# Altium project precharge.PrjPcb
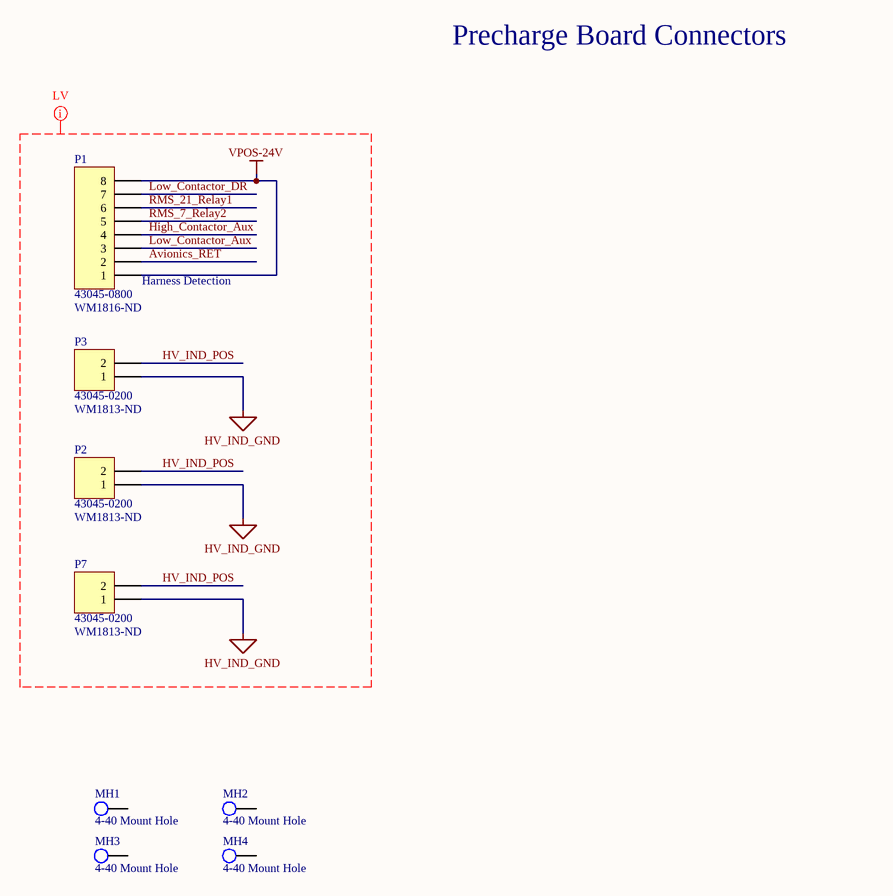
[diagram p0: connectors.SchDoc]
4 sheets, 59 parts. Net scope: global (net labels, ports and power ports of the same name join across sheets).
Board file: precharge.PcbDoc
Sheets:
  connectors.SchDoc
  indicator_light.SchDoc
  precharge_relays.SchDoc
  Contactors.SchDoc

## Sheet connectors.SchDoc: Connectors
size A4; Engineer: Shelby Riggleman; Organization: Badgerloop Electrical; Address1: 133 Engineering Research Building; Address2: 1500 Engineering Drive; Address3: Madison, Wi 53706; Revision: 1; SheetNumber: 2

### Parts
MH1  4-40 Mount Hole  [MH]
MH2  4-40 Mount Hole  [MH]
MH3  4-40 Mount Hole  [MH]
MH4  4-40 Mount Hole  [MH]
P1  43045-0800  Supplier Part Number 1: WM1816-ND  [430450800]
P2  43045-0200  Supplier Part Number 1: WM1813-ND  [430450200]
P3  43045-0200  Supplier Part Number 1: WM1813-ND  [430450200]
P7  43045-0200  Supplier Part Number 1: WM1813-ND  [430450200]

### Nets
HV_IND_GND: P2.1 P3.1 P7.1
VPOS-24V: P1.1 P1.8
Avionics_RET: P1.2
High_Contactor_Aux: P1.4
HV_IND_POS: P2.2 P3.2 P7.2
Low_Contactor_Aux: P1.3
Low_Contactor_DR: P1.7
RMS_7_Relay2: P1.5
RMS_21_Relay1: P1.6

Not connected (* = marked no-connect by the designer): MH1 46; MH2 46; MH3 46; MH4 46

### Layout directives
net class Low Voltage: Avionics_RET, High_Contactor_Aux, HV_IND_GND, HV_IND_POS, Low_Contactor_Aux, Low_Contactor_DR, RMS_7_Relay2, RMS_21_Relay1, VPOS-24V

### Notes on the sheet
- Precharge Board Connectors
- (near P1) Harness Detection
- Title
- Engineer:
- Date:
- Time:
- Revision:
- Sheet
- of
- File:

### Library data of the parts
P1 = 43045-0800: CONN HEADER R/A 8POS 3MM; Manufacturer: Molex; Number of Contacts: 8; Contact Resistance: 10mR; Max Voltage Rating (DC): 250.25kV; Current Rating: 5A; Voltage Rating (AC): 250V; Voltage Rating: 600V; Gender: Male; Insulation Resistance: 1GR; Approvals: UL,CSA,TUV; Glow Wire Compliant: Compliant; Supplier 1: Digi-Key; Manufacturer Part Number: 43045-0800; Stock 1: 2632; Pricing 1: 1=1.91000, 10=1.73100, 100=1.48390, 500=1.23656, 1000=1.05990, 5000=0.93978, 10000=0.91858 (USD); RoHS: Yes; Mount: Through Hole; Case/Package: SMC; Contact Plating: Tin; Contact Material: Brass,Tin; Color: Black; Housing Color: Black; Housing Material: Thermoplastic; Material: Polyester; Min Operating Temperature: -40°C; Max Operating Temperature: 105°C; Number of Rows: 2; Termination: Solder; Packaging: Tray; Number of Positions: 8; Orientation: Right Angle; Number of Poles: 8; Package Quantity: 1440; Max Current Rating: 5A; Number of Circuits: 8; Working Voltage: 250V; Voltage Rating (DC): 250V; Diameter: 3mm; Length: 16.15mm; Height: 8.77mm; Pitch: 3mm; Row Spacing: 3mm; Depth: 12.2mm; Radiation Hardening: No; Flammability Rating: UL94 V-0; REACH SVHC: Unknown; Halogen Free: Low Halogen; Lead Free: Lead Free; ComponentLink1URL: https://datasheet.ciiva.com/5158/0430450800-pcb-headers-142625-5158817.pdf?src-supplier=Mouser; ComponentLink1Description: https://datasheet.ciiva.com/5158/0430450800-pcb-headers-142625-5158817.pdf?src-supplier=Mouser; ComponentLink2URL: https://datasheet.ciiva.com/7683/27645-7683683.pdf?src-supplier=Element14; ComponentLink2Description: https://datasheet.ciiva.com/7683/27645-7683683.pdf?src-supplier=Element14; ComponentLink3URL: https://datasheet.ciiva.com/19462/883536-19462164.pdf?src-supplier=Jameco; ComponentLink3Description: https://datasheet.ciiva.com/19462/883536-19462164.pdf?src-supplier=Jameco; ComponentLink4URL: https://datasheet.ciiva.com/11751/0900766b80027348-11751142.pdf?src-supplier=RSComponents; ComponentLink4Description: https://datasheet.ciiva.com/11751/0900766b80027348-11751142.pdf?src-supplier=RSComponents; ComponentLink5URL: https://datasheet.ciiva.com/30198/267770430450800-pcb-headers-30198875.pdf?src-supplier=Onlinecomponents.com; ComponentLink5Description: https://datasheet.ciiva.com/30198/267770430450800-pcb-headers-30198875.pdf?src-supplier=Onlinecomponents.com; ComponentLink6URL: https://datasheet.ciiva.com/1443/1850016-1443537.pdf?src-supplier=Element14; ComponentLink6Description: https://datasheet.ciiva.com/1443/1850016-1443537.pdf?src-supplier=Element14; ComponentLink7URL: https://datasheet.ciiva.com/14155/04402310-14155206.pdf?src-supplier=Distrelec; ComponentLink7Description: https://datasheet.ciiva.com/14155/04402310-14155206.pdf?src-supplier=Distrelec; ComponentLink8URL: https://datasheet.ciiva.com/16657/0430450800-pcb-headers-16657964.pdf?src-supplier=Avnet+Europe; ComponentLink8Description: https://datasheet.ciiva.com/16657/0430450800-pcb-headers-16657964.pdf?src-supplier=Avnet+Europe; ComponentLink9URL: https://datasheet.ciiva.com/10087/0430450800-pcb-headers-10087853.pdf?src-supplier=Avnet; ComponentLink9Description: https://datasheet.ciiva.com/10087/0430450800-pcb-headers-10087853.pdf?src-supplier=Avnet
P2 P3 P7 = 43045-0200: CONN HEADER R/A 2POS; Manufacturer: Molex; Contact Resistance: 10mR; Number of Contacts: 2; Voltage Rating: 600V; Current Rating: 5A; Gender: Male; Max Voltage Rating (DC): 250.25kV; Voltage Rating (DC): 250V; Insulation Resistance: 1GR; Pitch: 3mm; Glow Wire Compliant: Compliant; Approvals: UL,CSA,TUV; Supplier 1: Digi-Key; Manufacturer Part Number: 43045-0200; Stock 1: 6320; Pricing 1: 1=0.97000, 10=0.84900, 100=0.73280, 500=0.59958, 1000=0.53296, 5000=0.46634, 10000=0.44302 (USD); RoHS: Yes; Mount: Through Hole; Case/Package: SMC; Contact Plating: Tin; Color: Black; Contact Material: Brass,Tin; Housing Color: Black; Housing Material: Thermoplastic; Material: Thermoplastic; Min Operating Temperature: -40°C; Max Operating Temperature: 105°C; Termination: Through Hole; Number of Rows: 2; Orientation: Right Angle; Packaging: Tray; Number of Positions: 2; Package Quantity: 3168; Number of Circuits: 2; Contact Gender: Male; Diameter: 3mm; Row Spacing: 3mm; Radiation Hardening: No; Flammability Rating: UL94 V-0; REACH SVHC: Unknown; Lead Free: Lead Free; Halogen Free: Low Halogen; ComponentLink1URL: https://datasheet.ciiva.com/14155/04402310-14155203.pdf?src-supplier=Distrelec; ComponentLink1Description: https://datasheet.ciiva.com/14155/04402310-14155203.pdf?src-supplier=Distrelec; ComponentLink2URL: https://datasheet.ciiva.com/19454/883270-19454006.pdf?src-supplier=Jameco; ComponentLink2Description: https://datasheet.ciiva.com/19454/883270-19454006.pdf?src-supplier=Jameco; ComponentLink3URL: https://datasheet.ciiva.com/5150/0430450200-pcb-headers-145770-5150407.pdf?src-supplier=Mouser; ComponentLink3Description: https://datasheet.ciiva.com/5150/0430450200-pcb-headers-145770-5150407.pdf?src-supplier=Mouser; ComponentLink4URL: https://datasheet.ciiva.com/11747/0900766b80027348-11747001.pdf?src-supplier=RSComponents; ComponentLink4Description: https://datasheet.ciiva.com/11747/0900766b80027348-11747001.pdf?src-supplier=RSComponents; ComponentLink5URL: https://datasheet.ciiva.com/16656/0430450200-pcb-headers-16656330.pdf?src-supplier=Avnet+Europe; ComponentLink5Description: https://datasheet.ciiva.com/16656/0430450200-pcb-headers-16656330.pdf?src-supplier=Avnet+Europe; ComponentLink6URL: https://datasheet.ciiva.com/10090/0430450200-pcb-headers-10090299.pdf?src-supplier=Avnet; ComponentLink6Description: https://datasheet.ciiva.com/10090/0430450200-pcb-headers-10090299.pdf?src-supplier=Avnet; ComponentLink7URL: https://datasheet.ciiva.com/36854/124280430450200-pcb-headers-36854331.pdf?src-supplier=Onlinecomponents.com; ComponentLink7Description: https://datasheet.ciiva.com/36854/124280430450200-pcb-headers-36854331.pdf?src-supplier=Onlinecomponents.com; ComponentLink8URL: https://datasheet.ciiva.com/1443/1859921-1443437.pdf?src-supplier=Element14; ComponentLink8Description: https://datasheet.ciiva.com/1443/1859921-1443437.pdf?src-supplier=Element14

## Sheet indicator_light.SchDoc: HV Indicator Light
size A4; Organization: Badgerloop; Address1: 133 Engineering Research; Address2: Building; Address3: Madison, WI 53715; Revision: 1; SheetNumber: 3
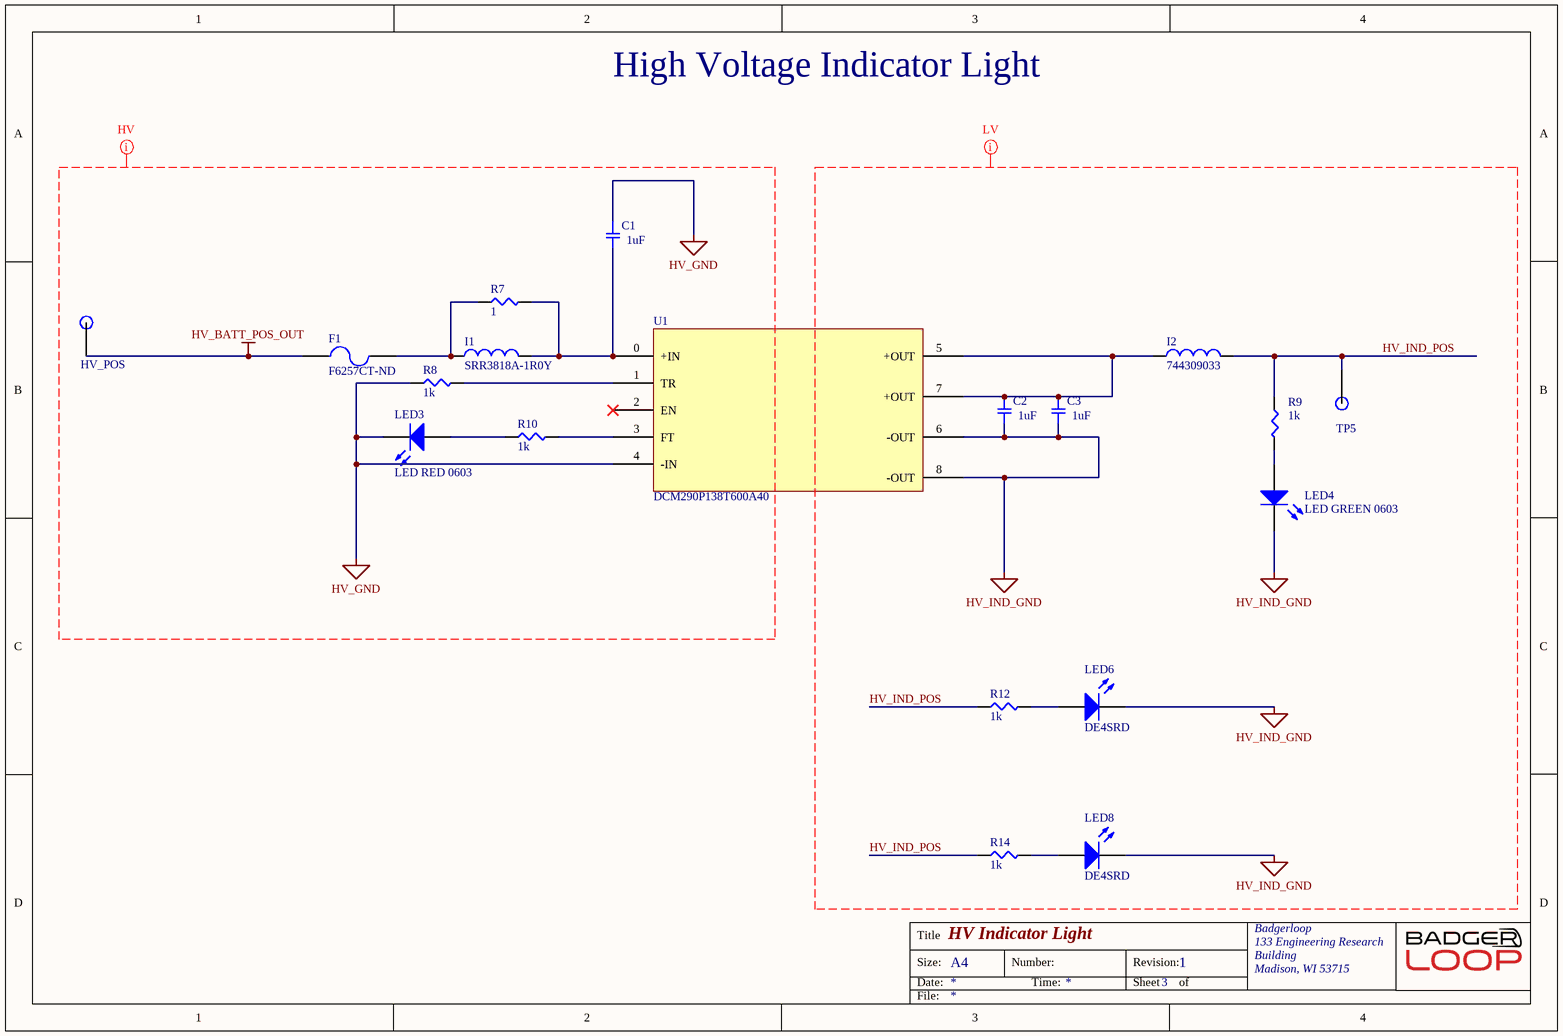
[diagram p1: indicator_light.SchDoc]

### Parts
C1  Capacitance: 1uF  [CAPC5860X28N]  (hidden comment: CGA9P4X7T2W105K250KE_1)
C2  Capacitance: 1uF  [CAPC5860X28N]  (hidden comment: CGA9P4X7T2W105K250KE_1)
C3  Capacitance: 1uF  [CAPC5860X28N]  (hidden comment: CGA9P4X7T2W105K250KE_1)
F1  F6257CT-ND  [FUSE BOARD MNT 500MA 350VAC/VDC]
HV_POS  TP  [Test Point]  (value not drawn)
I1  SRR3818A-1R0Y  [INDM3838X18N]
I2  744309033  [INDM140130X90N]
LED3  LED RED 0603  [LED 0603 RED]
LED4  LED GREEN 0603  [LED 0603 GREEN]
LED6  DE4SRD  [DE4SRD]
LED8  DE4SRD  [DE4SRD]
R7  1  [SMD-0805-RES]
R8  1k  [SMD-0805-RES]
R9  1k  [SMD-0805-RES]
R10  1k  [SMD-0805-RES]
R12  1k  [SMD-0805-RES]
R14  1k  [SMD-0805-RES]
TP5  TP  [Test Point]  (value not drawn)
U1  DCM290P138T600A40  [DCM290y138x600A40]

### Nets
HV_BATT_POS_OUT: F1.1 HV_POS.1
HV_GND: C1.1 LED3.2(K) R8.1 U1.4(-IN)
HV_IND_GND: C2.2 C3.2 LED4.2(K) LED6.2(K) LED8.2(K) U1.6(-OUT) U1.8(-OUT)
HV_IND_POS: I2.2 R9.1 R12.1 R14.1 TP5.1
NetC1_2: C1.2 I1.2 R7.2 U1.0(+IN)
NetC2_1: C2.1 C3.1 I2.1 U1.5(+OUT) U1.7(+OUT)
NetF1_2: F1.2 I1.1 R7.1
NetLED3_1: LED3.1(A) R10.1
NetLED4_1: LED4.1(A) R9.2
NetLED6_1: LED6.1(A) R12.2
NetLED8_1: LED8.1(A) R14.2
NetR8_2: R8.2 U1.1(TR)
NetR10_2: R10.2 U1.3(FT)

Not connected (* = marked no-connect by the designer): U1 2(EN)*

### Layout directives
net class High Voltage: HV_BATT_POS_OUT, HV_GND
net class Low Voltage: HV_IND_GND, HV_IND_POS

### Notes on the sheet
- High Voltage Indicator Light
- Title
- Size:
- Date:
- A4
- Number:
- Time:
- Revision:
- Sheet
- of
- File:

### Library data of the parts
C1-C3 = CGA9P4X7T2W105K250KE_1: CAP CER 1UF 450V X7T 2220; Manufacturer: TDK; Tolerance: 10%; Supplier 1: Digi-Key; Manufacturer Part Number: CGA9P4X7T2W105K250KE; Stock 1: 10698; Pricing 1: 1=3.67, 10=2.957, 100=2.3064 (USD); Mount: Surface Mount; Case/Package: 2220; Weight: 0.016932oz; Case Code (Metric): 5750; Case Code (Imperial): 2220; Min Operating Temperature: -55°C; Max Operating Temperature: 125°C; Voltage Rating: 450V; Packaging: Tape and Reel; Termination: SMD/SMT; Package Quantity: 1; Voltage Rating (DC): 450V; Dielectric: X7T; Features: Soft Termination; Length: 5.7mm; Height: 2.5mm; Width: 0.197inch; Thickness: 0.11inch; Depth: 5mm; Ratings: AEC-Q200; REACH SVHC: No SVHC; ComponentLink1URL: http://www.mouser.com/ds/2/400/lcc_commercial_soft_en-775842.pdf?src-supplier=Mouser; ComponentLink1Description: http://www.mouser.com/ds/2/400/lcc_commercial_soft_en-775842.pdf?src-supplier=Mouser; ComponentLink2URL: http://www.farnell.com/datasheets/1839935.pdf?src-supplier=Element14; ComponentLink2Description: http://www.farnell.com/datasheets/1839935.pdf?src-supplier=Element14; Supplier Part Number 1: 445-8765-6-ND
F1 = F6257CT-ND: FUSE BOARD MNT 500MA 350VAC/VDC; Manufacturer: Littelfuse; Manufacturer P/N: 46205000000; Digikey P/N: F6257CT-ND; Digikey Link: https://www.digikey.com/product-detail/en/littelfuse-inc/46205000000/F6257CT-ND/4331764
HV_POS TP5 = TP: SMD TEST POINT
I1 = SRR3818A-1R0Y: FIXED IND 1UH 3.6A 37 MOHM SMD; Manufacturer: Bourns Inc.; Digikey Link: https://www.digikey.com/product-detail/en/bourns-inc/SRR3818A-1R0Y/SRR3818A-1R0YCT-ND/7556036; Digikey P/N: SRR3818A-1R0YCT-ND; Manufacturer P/N: SRR3818A-1R0Y
I2 = 744309033: FIXED IND 330NH 47.5A 0.165 MOHM; Manufacturer: Wurth; Digikey Link: https://www.digikey.com/product-detail/en/wurth-electronics-inc/744309033/732-3006-1-ND/2626130; Digikey P/N: 732-3006-1-ND; Manufacturer P/N: 744309033
LED3 = LED RED 0603: Red 631nm LED Indication - Discrete 2V 0603 (1608 Metric); Manufacturer: Lite-On Inc.; Manufacturer P/N: LTST-C190KRKT; Digikey P/N: 160-1436-1-ND; Package / Case: 0603; Color: RED
LED4 = LED GREEN 0603: Manufacturer: Lite-On Inc.; Manufacturer P/N: LTST-C190KGKT; Digikey P/N: 160-1435-1-ND; Package / Case: 0603; Color: GREEN
LED6 LED8 = DE4SRD: LED Bars and Arrays Red 640nm 300mcd Diffused Light Bar; Manufacturer: Kingbright; Lens Style: Diffused,Tinted; Voltage Rating: 1.85V; Luminous Intensity: 340mcd; Current: 30mA; Forward Current: 20mA; Power Rating: 75mW; Element Configuration: Single; Supplier 1: Digi-Key; Manufacturer Part Number: DE4SRD; Stock 1: 3382; Pricing 1: 1=2.5, 10=2.217, 100=1.287, 500=1.144, 1000=0.98313, 2500=0.9295 (USD); Mount: Through Hole; Color: Red; Package Quantity: 33; Forward Voltage: 1.85V; Packaging: Rail/Tube; Illumination Color: Red; Lead Free: Lead Free; ComponentLink1URL: http://www.mouser.com/ds/2/216/DE4SRD-69987.pdf?src-supplier=Mouser; ComponentLink1Description: http://www.mouser.com/ds/2/216/DE4SRD-69987.pdf?src-supplier=Mouser; ComponentLink2URL: http://www.kingbrightusa.com/images/catalog/SPEC/DE4SRD.pdf?src-supplier=Digi-Key; ComponentLink2Description: http://www.kingbrightusa.com/images/catalog/SPEC/DE4SRD.pdf?src-supplier=Digi-Key; Supplier Part Number 1: 754-1672-5-ND
R7 = ERJ-6BQJ1R0V: RES SMD 1 OHM 5% 1/3W 0805; Manufacturer: Panasonic Electronic Components; Factory Stock: 0; Unit Price (USD): 0.07603; @ qty: 1500; Power (Watts): 0.333W, 1/3W; Temperature Coefficient: ±200ppm/°C; Part Number: ERJ-6BQJ1R0V; Datasheets: https://industrial.panasonic.com/cdbs/www-data/pdf/RDA0000/AOA0000C239.pdf; Image: //media.digikey.com/Renders/Panasonic%20Renders/ERJ-0805%20Pkg.jpg; Digi-Key Part Number: P17527CT-ND; Quantity Available: 4990; Minimum Quantity: 1; Packaging: Cut Tape (CT); Series: ERJ; Part Status: Active; Value: 1; Tolerance: ±5%; Composition: Thick Film; Features: Automotive AEC-Q200, Current Sense; Operating Temperature: -55°C ~ 125°C; Package / Case: 0805 (2012 Metric); Supplier Device Package: 0805; Size / Dimension: 0.079" L x 0.049" W (2.00mm x 1.25mm); Height - Seated (Max): 0.028" (0.70mm); Number of Terminations: 2; Failure Rate: -
R8-R10 R12 R14 = ERJ-6ENF1001V: RES SMD 1K OHM 1% 1/8W 0805; Manufacturer: Panasonic Electronic Components; Factory Stock: 0; Unit Price (USD): 0.00729; @ qty: 1500; Minimum Quantity: 1; Power (Watts): 0.125W, 1/8W; Temperature Coefficient: ±100ppm/°C; Part Number: ERJ-6ENF1001V; Datasheets: http://industrial.panasonic.com/www-cgi/jvcr13pz.cgi?E+PZ+3+AOA0002+ERJ6ENF1001V+7+WW; Image: //media.digikey.com/Renders/Panasonic%20Renders/ERJ-0805%20Pkg.jpg; Digi-Key Part Number: P1.00KCCT-ND; Quantity Available: 12895103; Packaging: Cut Tape (CT); Series: ERJ; Part Status: Active; Value: 1k; Tolerance: ±1%; Composition: Thick Film; Features: Automotive AEC-Q200; Operating Temperature: -55°C ~ 155°C; Package / Case: 0805 (2012 Metric); Supplier Device Package: 0805; Size / Dimension: 0.079" L x 0.049" W (2.00mm x 1.25mm); Height - Seated (Max): 0.028" (0.70mm); Number of Terminations: 2; Failure Rate: -
U1 = DCM290P138T600A40: DC DC CONVERTER 13.8V 600W; Manufacturer: Vicor; Manufacturer P/N: DCM290P138T600A40; Digikey Link: https://www.digikey.com/product-detail/en/vicor-corporation/DCM290P138T600A40/1102-5388-ND/4860626; Digikey P/N: 1102-5388-ND

## Sheet precharge_relays.SchDoc: Precharge Relays
size A4; Engineer: Shelby Riggleman; Organization: Badgerloop; Address1: 133 Engineering Research; Address2: Building; Address3: Madison, WI 53715; Revision: 1; SheetNumber: 4
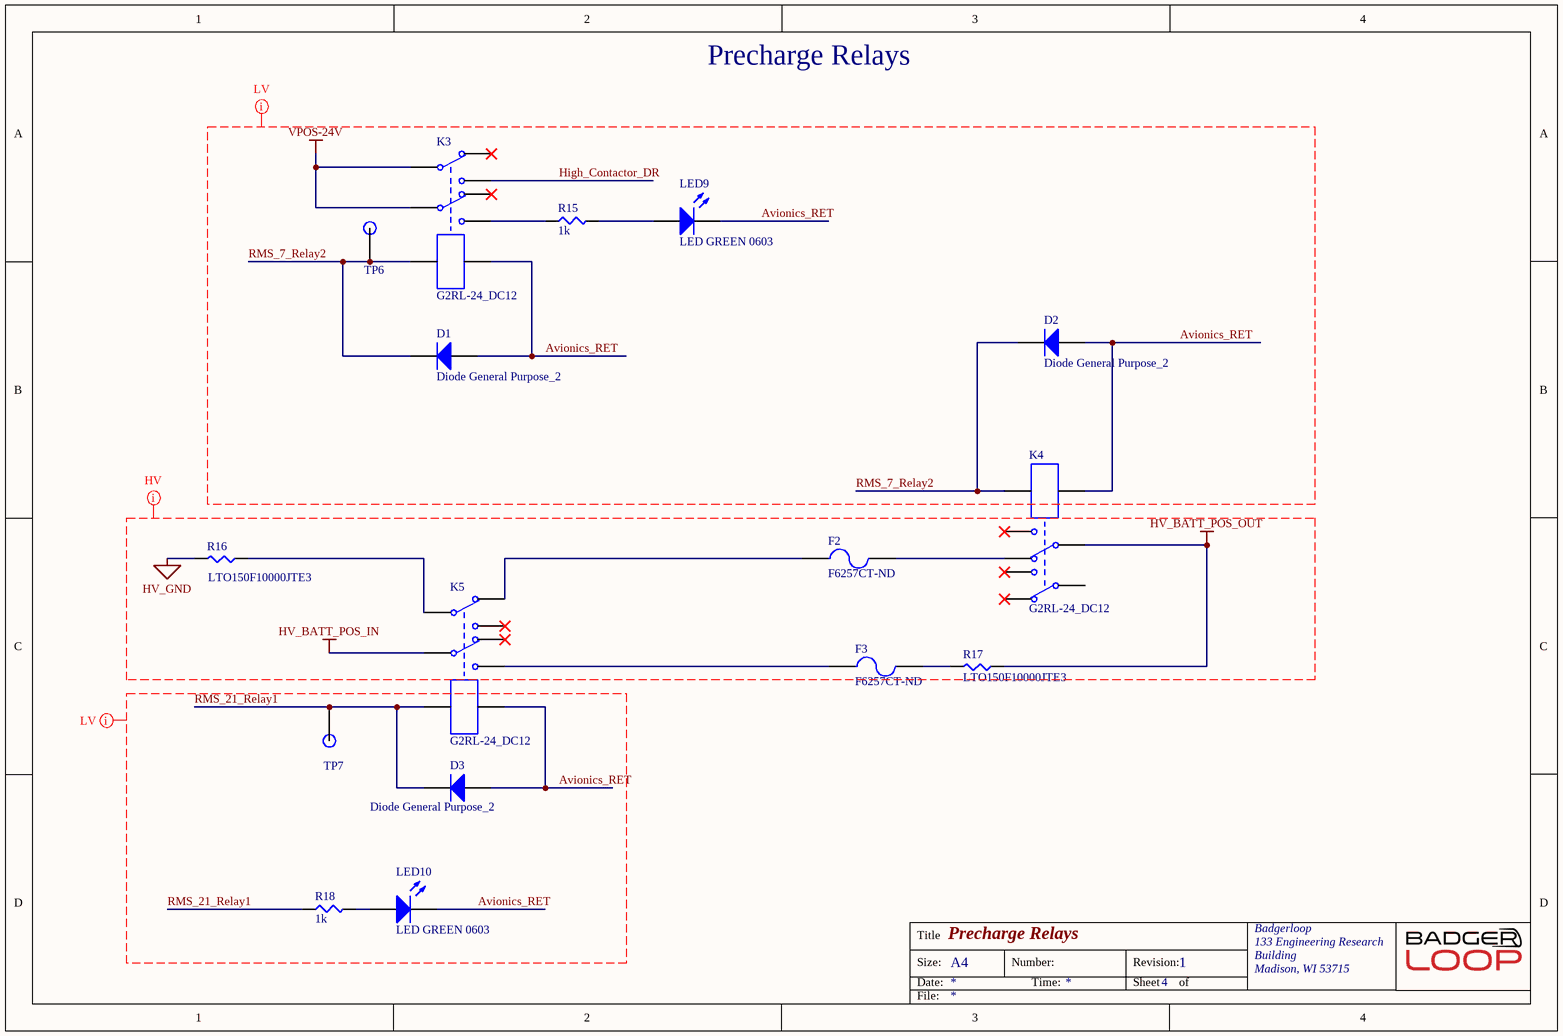
[diagram p2: precharge_relays.SchDoc]

### Parts
D1  Diode General Purpose_2  [SODFL250X110-2N]
D2  Diode General Purpose_2  [SODFL250X110-2N]
D3  Diode General Purpose_2  [SODFL250X110-2N]
F2  F6257CT-ND  [FUSE BOARD MNT 500MA 350VAC/VDC]
F3  F6257CT-ND  [FUSE BOARD MNT 500MA 350VAC/VDC]
K3  G2RL-24_DC12  [G2RL]
K4  G2RL-24_DC12  [G2RL]
K5  G2RL-24_DC12  [G2RL]
LED9  LED GREEN 0603  [LED 0603 GREEN]
LED10  LED GREEN 0603  [LED 0603 GREEN]
R15  1k  [SMD-0805-RES]
R16  LTO150F10000JTE3  [TO-247-2]
R17  LTO150F10000JTE3  [TO-247-2]
R18  1k  [SMD-0805-RES]
TP6  TP  [Test Point]  (value not drawn)
TP7  TP  [Test Point]  (value not drawn)

### Nets
HV_BATT_POS_IN: K5.6
HV_BATT_POS_OUT: K4.6 R17.1
HV_GND: R16.2
VPOS-24V: K3.3 K3.6
Avionics_RET: D1.1(A) D2.1(A) D3.1(A) K3.8 K4.1 K5.8 LED9.2(K) LED10.2(K)
High_Contactor_DR: K3.4
RMS_7_Relay2: D1.2(K) D2.2(K) K3.1 K4.8 TP6.1
RMS_21_Relay1: D3.2(K) K5.1 R18.1 TP7.1
NetF2_1: F2.1 K5.2
NetF2_2: F2.2 K4.7
NetF3_1: F3.1 K5.5
NetF3_2: F3.2 R17.2
NetK3_5: K3.5 R15.1
NetK5_3: K5.3 R16.1
NetLED9_1: LED9.1(A) R15.2
NetLED10_1: LED10.1(A) R18.2

Not connected (* = marked no-connect by the designer): K3 2* 7*; K4 2* 3 4* 5*; K5 4* 7*

### Layout directives
net class High Voltage: HV_BATT_POS_IN, HV_BATT_POS_OUT, HV_GND
net class Low Voltage: Avionics_RET, High_Contactor_DR, RMS_7_Relay2, RMS_21_Relay1, VPOS-24V

### Notes on the sheet
- Precharge Relays
- Title
- Size:
- Date:
- A4
- Number:
- Time:
- Revision:
- Sheet
- of
- File:

### Library data of the parts
D1-D3 = Diode General Purpose_2: DIODE GEN PURP 20V 350MA SOD323; Manufacturer: Diodes Incorporated; Manufacturer P/N: SD103CWS-7-F; Digikey P/N: SD103CWS-FDIDKR-ND; Package / Case: SOD323; Do Not Populate: *; ComponentLink1Description: Digikey; ComponentLink1URL: https://www.digikey.com/product-detail/en/diodes-incorporated/SD103CWS-7-F/SD103CWS-FDIDKR-ND/1836772; ComponentLink2Description: Datasheet; ComponentLink2URL: https://www.diodes.com/assets/Datasheets/ds30101.pdf; ComponentLink3Description: Dimensions; ComponentLink3URL: https://www.diodes.com/assets/Package-Files/SOD323.pdf
F2 F3 = F6257CT-ND: as F1 on sheet indicator_light; Digikey P/N: F6257CT-ND; Digikey Link: https://www.digikey.com/product-detail/en/littelfuse-inc/46205000000/F6257CT-ND/4331764
K3-K5 = G2RL-24_DC12: RELAY GEN PURPOSE DPDT 8A 12V; Manufacturer: Omron Electronics; Manufacturer P/N: G2RL-24 DC12; Digikey Link: https://www.digikey.com/product-detail/en/omron-electronics-inc-emc-div/G2RL-24-DC12/Z147-ND/307667; Digikey P/N: Z147-ND
LED9 LED10 = LED GREEN 0603: as LED4 on sheet indicator_light; Digikey P/N: 160-1435-1-ND; Package / Case: 0603; Color: GREEN
R15 R18 = ERJ-6ENF1001V: as R8 on sheet indicator_light; Part Number: ERJ-6ENF1001V; Datasheets: http://industrial.panasonic.com/www-cgi/jvcr13pz.cgi?E+PZ+3+AOA0002+ERJ6ENF1001V+7+WW; Image: //media.digikey.com/Renders/Panasonic%20Renders/ERJ-0805%20Pkg.jpg; Digi-Key Part Number: P1.00KCCT-ND; Quantity Available: 12895103; Packaging: Cut Tape (CT); Series: ERJ; Part Status: Active; Value: 1k; Tolerance: ±1%; Composition: Thick Film; Features: Automotive AEC-Q200; Operating Temperature: -55°C ~ 155°C; Package / Case: 0805 (2012 Metric); Supplier Device Package: 0805; Size / Dimension: 0.079" L x 0.049" W (2.00mm x 1.25mm); Height - Seated (Max): 0.028" (0.70mm); Number of Terminations: 2; Failure Rate: -
R16 R17 = LTO150F10000JTE3: RES 1K OHM 5% 150W TO247-2; Manufacturer: Vishay Sfernice; Supplier 1: Digi-Key; Manufacturer Part Number: LTO150F10000JTE3; Stock 1: 9; Pricing 1: 1=12.19, 10=11.084, 100=7.8972, 1000=7.17808 (USD); ComponentLink1URL: https://media.digikey.com/pdf/Data%20Sheets/Vishay%20Sfernice%20PDFs/LTO_150_Series.pdf?src-supplier=Digi-Key; ComponentLink1Description: https://media.digikey.com/pdf/Data%20Sheets/Vishay%20Sfernice%20PDFs/LTO_150_Series.pdf?src-supplier=Digi-Key; Supplier Part Number 1: 716-1214-ND; Digikey Link: https://www.digikey.com/products/en/resistors/through-hole-resistors/53?k=Power+Resistors&k=&pkeyword=Power+Resistors&sv=0&pv2=127&sf=0&FV=ffe00035%2Cmu1kOhms%7C2085%7C0%2Cmu1kOhms%7C2085%7C1&quantity=&ColumnSort=0&page=1&pageSize=25
TP6 TP7 = TP: SMD TEST POINT

## Sheet Contactors.SchDoc: HV Contactors
size A4; Engineer: Shelby Riggleman; Organization: Badgerloop; Address1: 133 Engineering Research; Address2: Building; Address3: Madison, WI 53715; Revision: 1; SheetNumber: 5
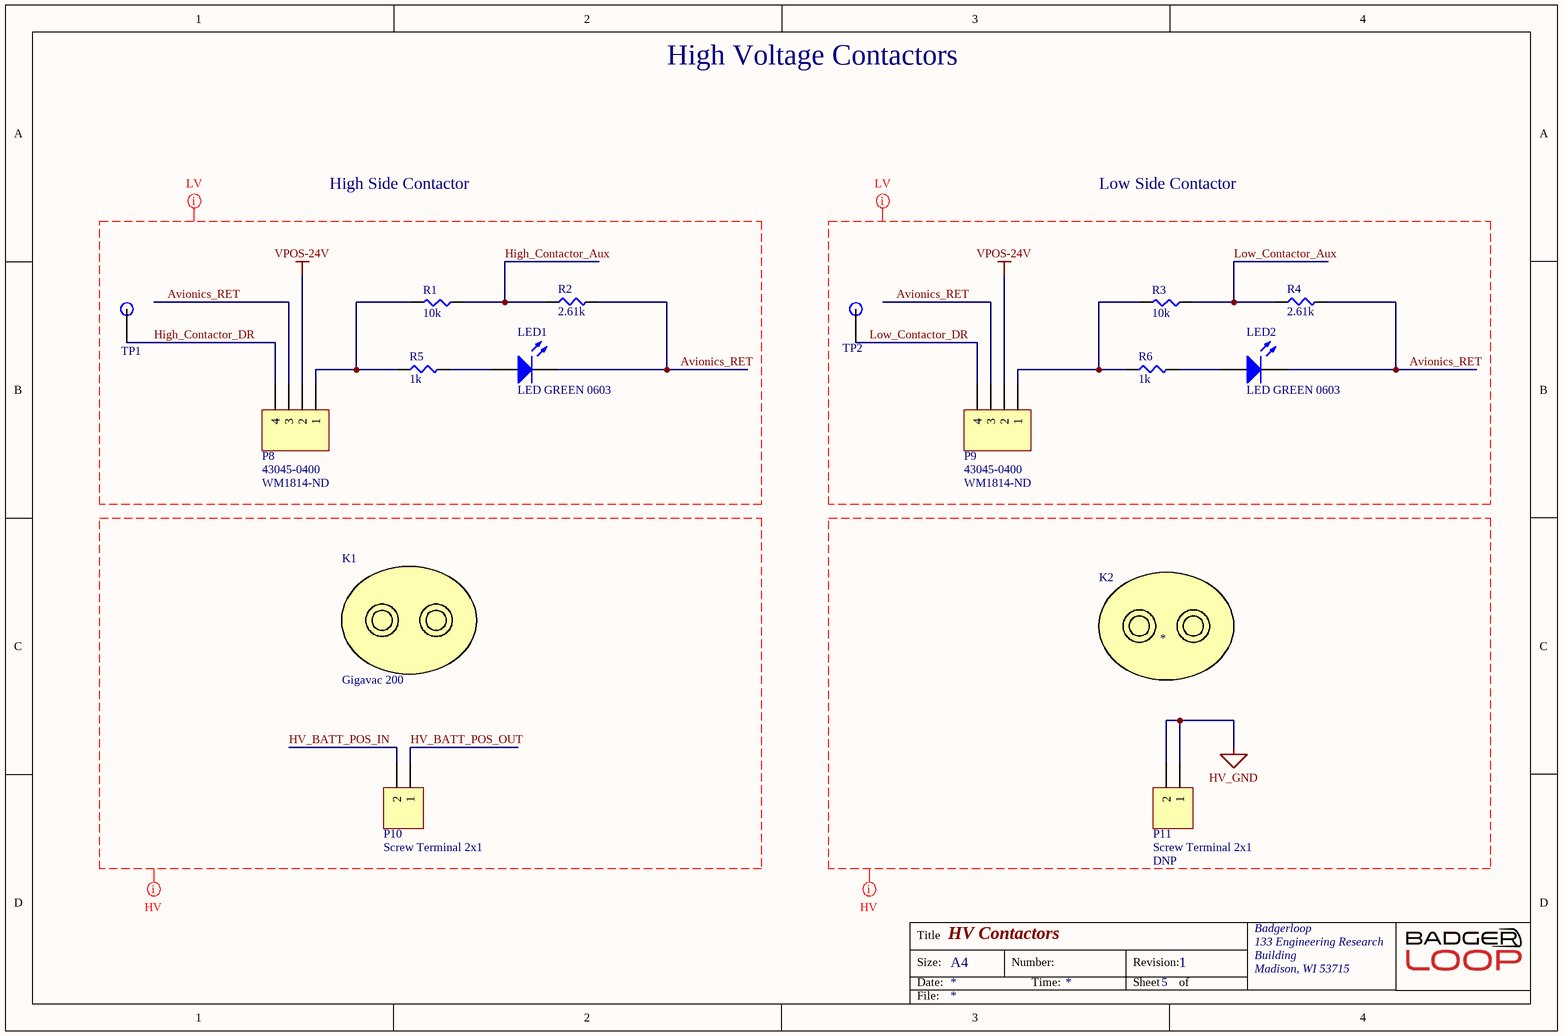
[diagram p3: Contactors.SchDoc]

### Parts
K1  Gigavac 200  [Gigavac 200]
K2  *  [Gigavac 200]
LED1  LED GREEN 0603  [LED 0603 GREEN]
LED2  LED GREEN 0603  [LED 0603 GREEN]
P8  43045-0400  Supplier Part Number 1: WM1814-ND  [430450400]
P9  43045-0400  Supplier Part Number 1: WM1814-ND  [430450400]
P10  Screw Terminal 2x1  [2POS TERM BLOCK]
P11  Screw Terminal 2x1  [2POS TERM BLOCK]
R1  10k  [SMD-0805-RES]
R2  2.61k  [SMD-1206-RES]
R3  10k  [SMD-0805-RES]
R4  2.61k  [SMD-1206-RES]
R5  1k  [SMD-0805-RES]
R6  1k  [SMD-0805-RES]
TP1  TP  [Test Point]  (value not drawn)
TP2  TP  [Test Point]  (value not drawn)

### Nets
HV_BATT_POS_IN: P10.2
HV_BATT_POS_OUT: P10.1
HV_GND: P11.1 P11.2
VPOS-24V: P8.2 P9.2
Avionics_RET: LED1.2(K) LED2.2(K) P8.3 P9.3 R2.2 R4.2
High_Contactor_Aux: R1.1 R2.1
High_Contactor_DR: P8.4 TP1.1
Low_Contactor_Aux: R3.1 R4.1
Low_Contactor_DR: P9.4 TP2.1
NetLED1_1: LED1.1(A) R5.2
NetLED2_1: LED2.1(A) R6.2
NetP8_1: P8.1 R1.2 R5.1
NetP9_1: P9.1 R3.2 R6.1

### Layout directives
net class High Voltage: HV_BATT_POS_IN, HV_BATT_POS_OUT, HV_GND
net class Low Voltage: Avionics_RET, High_Contactor_Aux, High_Contactor_DR, Low_Contactor_Aux, Low_Contactor_DR, VPOS-24V

### Notes on the sheet
- High Voltage Contactors
- High Side Contactor
- Low Side Contactor
- Title
- Size:
- Date:
- A4
- Number:
- Time:
- Revision:
- Sheet
- of
- File:

### Library data of the parts
K2 = Gigavac 200: ComponentLink1Description: http://www.gigavac.com/sites/default/files/catalog/spec_sheet/gv200.pdf; ComponentLink1URL: http://www.gigavac.com/sites/default/files/catalog/spec_sheet/gv200.pdf
LED1 LED2 = LED GREEN 0603: as LED4 on sheet indicator_light; Digikey P/N: 160-1435-1-ND; Package / Case: 0603; Color: GREEN
P8 P9 = 43045-0400: Male connector dual row 90° 3 mm Pole no. 2x2 Micro-Fit, 43045-0400, Molex; Contact Resistance: 10mR; Number of Contacts: 4; Max Voltage Rating (AC): 250V; Connector Type: Male Pin; Pitch: 3mm; Row Spacing: 0.118inch; Supplier 1: Digi-Key; Manufacturer: Molex; Manufacturer Part Number: 43045-0400; Stock 1: 5904; Pricing 1: 1=1.33000, 10=1.16700, 100=1.00670, 500=0.82368, 1000=0.73216, 5000=0.64064, 10000=0.60861 (USD); RoHS: Yes; Mount: Through Hole; Contact Plating: Tin; Color: Black; Contact Material: Brass; Housing Color: Black; Housing Material: Polymer; Min Operating Temperature: -40°C; Max Operating Temperature: 105°C; Number of Rows: 2; Termination: Solder; Packaging: Tray; Fastening Type: Ramp; Number of Positions: 4; Orientation: Right Angle; Length: 10.15mm; Depth: 12.2mm; Flammability Rating: UL94 V-0; ComponentLink1URL: https://datasheet.ciiva.com/712/430450200-sd-712017.pdf?src-supplier=Digi-Key; ComponentLink1Description: https://datasheet.ciiva.com/712/430450200-sd-712017.pdf?src-supplier=Digi-Key; ComponentLink2URL: https://datasheet.ciiva.com/20209/22-3744e-20209522.pdf?src-supplier=Rapid+Electronics; ComponentLink2Description: https://datasheet.ciiva.com/20209/22-3744e-20209522.pdf?src-supplier=Rapid+Electronics; ComponentLink3URL: https://datasheet.ciiva.com/11746/0900766b80027348-11746988.pdf?src-supplier=RSComponents; ComponentLink3Description: https://datasheet.ciiva.com/11746/0900766b80027348-11746988.pdf?src-supplier=RSComponents; ComponentLink4URL: https://datasheet.ciiva.com/30193/145420430450400-pcb-headers-30193310.pdf?src-supplier=Onlinecomponents.com; ComponentLink4Description: https://datasheet.ciiva.com/30193/145420430450400-pcb-headers-30193310.pdf?src-supplier=Onlinecomponents.com
P10 P11 = Screw Terminal 2x1: Screw Terminal, 2-Pin
  P11: DNP: DNP
R1 R3 = ERJ-P06J103V: RES SMD 10K OHM 5% 1/2W 0805; Manufacturer: Panasonic Electronic Components; Factory Stock: 0; Unit Price (USD): 0.01839; @ qty: 1500; Minimum Quantity: 1; Power (Watts): 0.5W, 1/2W; Temperature Coefficient: ±200ppm/°C; Part Number: ERJ-P06J103V; Datasheets: https://industrial.panasonic.com/cdbs/www-data/pdf/RDA0000/AOA0000C243.pdf; Image: //media.digikey.com/Renders/Panasonic%20Renders/ERJ-0805%20Pkg.jpg; Digi-Key Part Number: P10KADCT-ND; Quantity Available: 413576; Packaging: Cut Tape (CT); Series: ERJ; Part Status: Active; Value: 10k; Tolerance: ±5%; Composition: Thick Film; Features: Automotive AEC-Q200, Pulse Withstanding; Operating Temperature: -55°C ~ 155°C; Package / Case: 0805 (2012 Metric); Supplier Device Package: 0805; Size / Dimension: 0.079" L x 0.049" W (2.00mm x 1.25mm); Height - Seated (Max): 0.028" (0.70mm); Number of Terminations: 2; Failure Rate: -
R2 R4 = ERJ-8ENF2611V: RES SMD 2.61K OHM 1% 1/4W 1206; Manufacturer: Panasonic Electronic Components; Factory Stock: 0; Unit Price (USD): 0.00933; @ qty: 1500; Minimum Quantity: 1; Power (Watts): 0.25W, 1/4W; Temperature Coefficient: ±100ppm/°C; Part Number: ERJ-8ENF2611V; Datasheets: http://industrial.panasonic.com/www-cgi/jvcr13pz.cgi?E+PZ+3+AOA0002+ERJ8ENF2611V+7+WW; Image: //media.digikey.com/Renders/Panasonic%20Renders/ERJ-1206%20Pkg.jpg; Digi-Key Part Number: P2.61KFCT-ND; Quantity Available: 53359; Packaging: Cut Tape (CT); Series: ERJ; Part Status: Active; Value: 2.61k; Tolerance: ±1%; Composition: Thick Film; Features: Automotive AEC-Q200; Operating Temperature: -55°C ~ 155°C; Package / Case: 1206 (3216 Metric); Supplier Device Package: 1206; Size / Dimension: 0.126" L x 0.063" W (3.20mm x 1.60mm); Height - Seated (Max): 0.028" (0.70mm); Number of Terminations: 2; Failure Rate: -
R5 R6 = ERJ-6ENF1001V: as R8 on sheet indicator_light; Part Number: ERJ-6ENF1001V; Datasheets: http://industrial.panasonic.com/www-cgi/jvcr13pz.cgi?E+PZ+3+AOA0002+ERJ6ENF1001V+7+WW; Image: //media.digikey.com/Renders/Panasonic%20Renders/ERJ-0805%20Pkg.jpg; Digi-Key Part Number: P1.00KCCT-ND; Quantity Available: 12895103; Packaging: Cut Tape (CT); Series: ERJ; Part Status: Active; Value: 1k; Tolerance: ±1%; Composition: Thick Film; Features: Automotive AEC-Q200; Operating Temperature: -55°C ~ 155°C; Package / Case: 0805 (2012 Metric); Supplier Device Package: 0805; Size / Dimension: 0.079" L x 0.049" W (2.00mm x 1.25mm); Height - Seated (Max): 0.028" (0.70mm); Number of Terminations: 2; Failure Rate: -
TP1 TP2 = TP: SMD TEST POINT
K1 = Gigavac 200: ComponentLink1Description: http://www.gigavac.com/sites/default/files/catalog/spec_sheet/gv200.pdf; ComponentLink1URL: http://www.gigavac.com/sites/default/files/catalog/spec_sheet/gv200.pdf

## Nets that join several sheets
HV_BATT_POS_IN: precharge_relays (K5.6), Contactors (P10.2)
HV_BATT_POS_OUT: indicator_light (F1.1 HV_POS.1), precharge_relays (K4.6 R17.1), Contactors (P10.1)
HV_GND: indicator_light (C1.1 LED3.2 R8.1 U1.4), precharge_relays (R16.2), Contactors (P11.1 P11.2)
HV_IND_GND: connectors (P2.1 P3.1 P7.1), indicator_light (7 pins)
VPOS-24V: connectors (P1.1 P1.8), precharge_relays (K3.3 K3.6), Contactors (P8.2 P9.2)
Avionics_RET: connectors (P1.2), precharge_relays (8 pins), Contactors (6 pins)
High_Contactor_Aux: connectors (P1.4), Contactors (R1.1 R2.1)
High_Contactor_DR: precharge_relays (K3.4), Contactors (P8.4 TP1.1)
HV_IND_POS: connectors (P2.2 P3.2 P7.2), indicator_light (5 pins)
Low_Contactor_Aux: connectors (P1.3), Contactors (R3.1 R4.1)
Low_Contactor_DR: connectors (P1.7), Contactors (P9.4 TP2.1)
RMS_7_Relay2: connectors (P1.5), precharge_relays (5 pins)
RMS_21_Relay1: connectors (P1.6), precharge_relays (D3.2 K5.1 R18.1 TP7.1)